# Altium schematic sheet Encodeurs.Schematic.SchDoc
size A
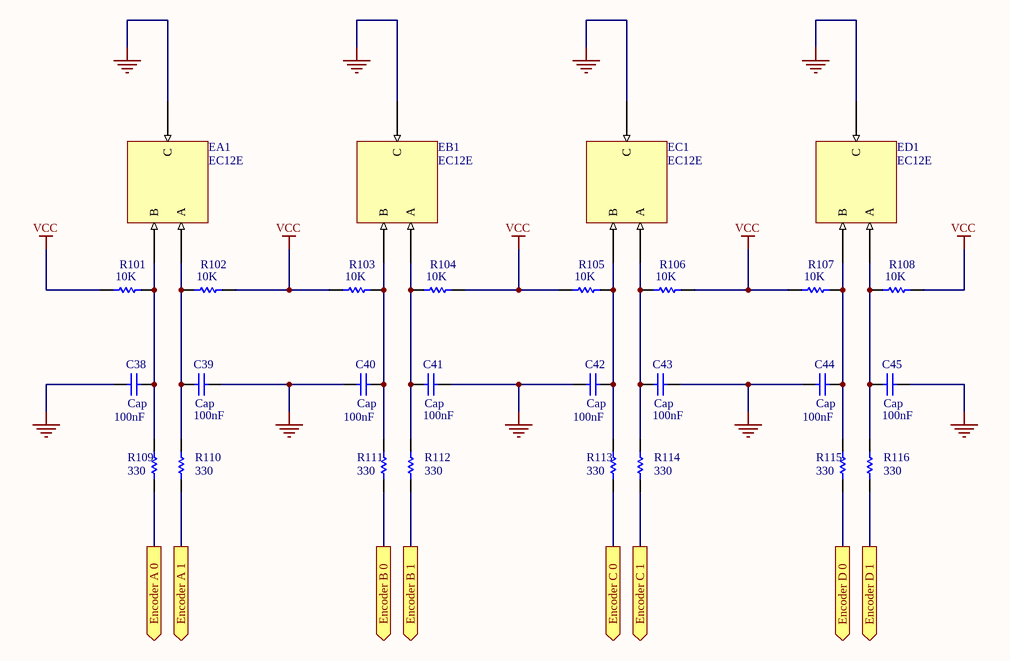
[diagram p0: Encodeurs.Schematic.SchDoc]

## Parts
C38  Cap  value 100nF  [CAPC1608N]
C39  Cap  value 100nF  [CAPC1608N]
C40  Cap  value 100nF  [CAPC1608N]
C41  Cap  value 100nF  [CAPC1608N]
C42  Cap  value 100nF  [CAPC1608N]
C43  Cap  value 100nF  [CAPC1608N]
C44  Cap  value 100nF  [CAPC1608N]
C45  Cap  value 100nF  [CAPC1608N]
EA1  EC12E  [EC12E]
EB1  EC12E  [EC12E]
EC1  EC12E  [EC12E]
ED1  EC12E  [EC12E]
R101  10K  [CAPC1608N]
R102  10K  [CAPC1608N]
R103  10K  [CAPC1608N]
R104  10K  [CAPC1608N]
R105  10K  [CAPC1608N]
R106  10K  [CAPC1608N]
R107  10K  [CAPC1608N]
R108  10K  [CAPC1608N]
R109  330  [CAPC1608N]
R110  330  [CAPC1608N]
R111  330  [CAPC1608N]
R112  330  [CAPC1608N]
R113  330  [CAPC1608N]
R114  330  [CAPC1608N]
R115  330  [CAPC1608N]
R116  330  [CAPC1608N]

## Ports
Encoder A 0 (out), Encoder A 1 (out), Encoder B 0 (out), Encoder B 1 (out), Encoder C 0 (out), Encoder C 1 (out), Encoder D 0 (out), Encoder D 1 (out)

## Nets
GND: C38.1 C39.1 C40.1 C41.1 C42.1 C43.1 C44.1 C45.1 EA1.3(C) EB1.3(C) EC1.3(C) ED1.3(C)
VCC: R101.1 R102.2 R103.1 R104.2 R105.1 R106.2 R107.1 R108.2
Encoder A 0: R109.1 ; port Encoder A 0
Encoder A 1: R110.1 ; port Encoder A 1
Encoder B 0: R111.1 ; port Encoder B 0
Encoder B 1: R112.1 ; port Encoder B 1
Encoder C 0: R113.1 ; port Encoder C 0
Encoder C 1: R114.1 ; port Encoder C 1
Encoder D 0: R115.1 ; port Encoder D 0
Encoder D 1: R116.1 ; port Encoder D 1
NetC38_2: C38.2 EA1.2(B) R101.2 R109.2
NetC39_2: C39.2 EA1.1(A) R102.1 R110.2
NetC40_2: C40.2 EB1.2(B) R103.2 R111.2
NetC41_2: C41.2 EB1.1(A) R104.1 R112.2
NetC42_2: C42.2 EC1.2(B) R105.2 R113.2
NetC43_2: C43.2 EC1.1(A) R106.1 R114.2
NetC44_2: C44.2 ED1.2(B) R107.2 R115.2
NetC45_2: C45.2 ED1.1(A) R108.1 R116.2

## Library data of the parts
C38-C45 = Cap: Capacitor; Published: 8-Jun-2000; LatestRevisionDate: 17-Jul-2002; LatestRevisionNote: Re-released for DXP Platform.; PackageReference: RAD-0.3; Publisher: Altium Limited; PackageDescription: Radial Cap, Thru-Hole; 2 Leads; 0.3 in Pin Spacing
R101-R108 = Res1: Resistor; Published: 8-Jun-2000; LatestRevisionDate: 17-Jul-2002; LatestRevisionNote: Re-released for DXP Platform.; PackageReference: AXIAL-0.3; Publisher: Altium Limited; PackageDescription: Axial Device, Thru-Hole; 2 Leads; 0.3 in Pin Spacing; Value: 10K
R109-R116 = Res1: Resistor; Value: 330R; Published: 8-Jun-2000; LatestRevisionDate: 17-Jul-2002; LatestRevisionNote: Re-released for DXP Platform.; PackageReference: AXIAL-0.3; Publisher: Altium Limited; PackageDescription: Axial Device, Thru-Hole; 2 Leads; 0.3 in Pin Spacing